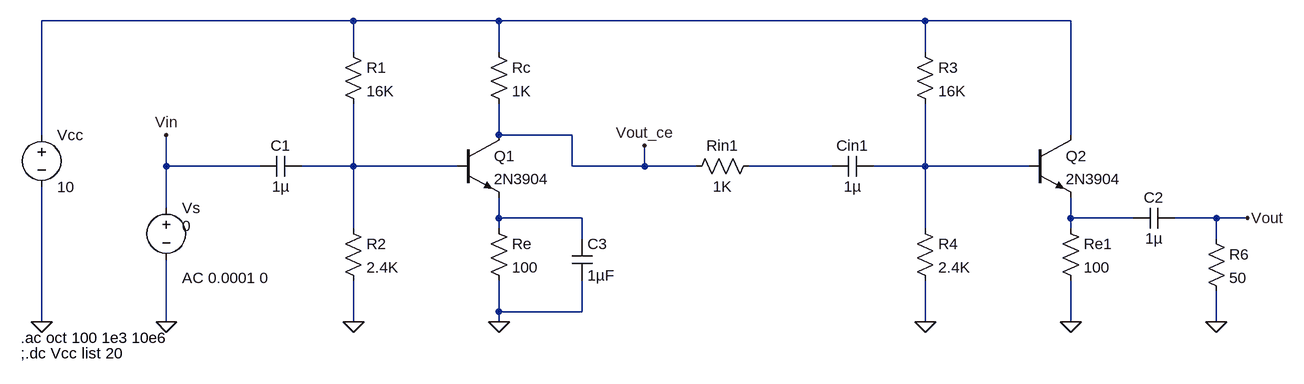
[diagram p0: schematic amp_stage1_ce_stage2_cc.asc]
amp_stage1_ce_stage2_cc.asc, the LTspice schematic file:
Version 4
SHEET 1 2324 680
WIRE 32 32 -448 32
WIRE 256 32 32 32
WIRE 912 32 256 32
WIRE 1136 32 912 32
WIRE 32 80 32 32
WIRE 256 80 256 32
WIRE 912 80 912 32
WIRE -448 208 -448 32
WIRE 256 208 256 160
WIRE 368 208 256 208
WIRE 1136 208 1136 32
WIRE -256 256 -256 208
WIRE -112 256 -256 256
WIRE 32 256 32 160
WIRE 32 256 -48 256
WIRE 192 256 32 256
WIRE 368 256 368 208
WIRE 480 256 480 224
WIRE 480 256 368 256
WIRE 560 256 480 256
WIRE 768 256 640 256
WIRE 912 256 912 160
WIRE 912 256 832 256
WIRE 1072 256 912 256
WIRE -256 320 -256 256
WIRE 256 336 256 304
WIRE 384 336 256 336
WIRE 1136 336 1136 304
WIRE 1232 336 1136 336
WIRE 1360 336 1296 336
WIRE 1408 336 1360 336
WIRE 32 352 32 256
WIRE 256 352 256 336
WIRE 912 352 912 256
WIRE 1136 352 1136 336
WIRE 384 368 384 336
WIRE 1360 368 1360 336
WIRE 256 480 256 432
WIRE 384 480 384 432
WIRE 384 480 256 480
WIRE -448 496 -448 288
WIRE -256 496 -256 400
WIRE 32 496 32 432
WIRE 256 496 256 480
WIRE 912 496 912 432
WIRE 1136 496 1136 432
WIRE 1360 496 1360 448
FLAG 256 496 0
FLAG 32 496 0
FLAG -256 496 0
FLAG -448 496 0
FLAG 480 224 Vout_ce
FLAG -256 208 Vin
FLAG 1136 496 0
FLAG 912 496 0
FLAG 1408 336 Vout
FLAG 1360 496 0
SYMBOL res 16 64 R0
SYMATTR InstName R1
SYMATTR Value 16K
SYMBOL res 16 336 R0
SYMATTR InstName R2
SYMATTR Value 2.4K
SYMBOL res 240 64 R0
SYMATTR InstName Rc
SYMATTR Value 1K
SYMBOL res 240 336 R0
SYMATTR InstName Re
SYMATTR Value 100
SYMBOL npn 192 208 R0
SYMATTR InstName Q1
SYMATTR Value 2N3904
SYMBOL cap -48 240 R90
WINDOW 0 0 32 VBottom 2
WINDOW 3 32 32 VTop 2
SYMATTR InstName C1
SYMATTR Value 1µ
SYMBOL voltage -448 192 R0
WINDOW 123 0 0 Left 0
WINDOW 39 0 0 Left 0
SYMATTR InstName Vcc
SYMATTR Value 10
SYMBOL voltage -256 304 R0
WINDOW 123 24 124 Left 2
WINDOW 39 0 0 Left 0
WINDOW 3 24 44 Left 2
SYMATTR Value2 AC 0.0001 0
SYMATTR Value 0
SYMATTR InstName Vs
SYMBOL cap 368 368 R0
SYMATTR InstName C3
SYMATTR Value 1µF
SYMBOL res 896 64 R0
SYMATTR InstName R3
SYMATTR Value 16K
SYMBOL res 896 336 R0
SYMATTR InstName R4
SYMATTR Value 2.4K
SYMBOL res 1120 336 R0
SYMATTR InstName Re1
SYMATTR Value 100
SYMBOL npn 1072 208 R0
SYMATTR InstName Q2
SYMATTR Value 2N3904
SYMBOL cap 832 240 R90
WINDOW 0 0 32 VBottom 2
WINDOW 3 32 32 VTop 2
SYMATTR InstName Cin1
SYMATTR Value 1µ
SYMBOL res 656 240 R90
WINDOW 0 0 56 VBottom 2
WINDOW 3 32 56 VTop 2
SYMATTR InstName Rin1
SYMATTR Value 1K
SYMBOL cap 1296 320 R90
WINDOW 0 0 32 VBottom 2
WINDOW 3 32 32 VTop 2
SYMATTR InstName C2
SYMATTR Value 1µ
SYMBOL res 1344 352 R0
SYMATTR InstName R6
SYMATTR Value 50
TEXT -480 520 Left 2 !.ac oct 100 1e3 10e6
TEXT -480 544 Left 2 !;.dc Vcc list 20

The netlist it stands for:
* amp_stage1_ce_stage2_cc.asc
R1 N001 N002 16K
R2 N002 0 2.4K
Rc N001 Vout_ce 1K
Re N005 0 100
Q1 Vout_ce N002 N005 0 2N3904
C1 N002 Vin 1µ
Vcc N001 0 10
Vs Vin 0 0 AC 0.0001 0
C3 N005 0 1µF
R3 N001 N004 16K
R4 N004 0 2.4K
Re1 N006 0 100
Q2 N001 N004 N006 0 2N3904
Cin1 N004 N003 1µ
Rin1 N003 Vout_ce 1K
C2 Vout N006 1µ
R6 Vout 0 50
.model NPN NPN
.model PNP PNP
.lib standard.bjt
.ac oct 100 1e3 10e6
;.dc Vcc list 20
.backanno
.end